# EAGLE design Mixer-Analog-OPA1644-Rev-D (EAGLE 8.5.0)
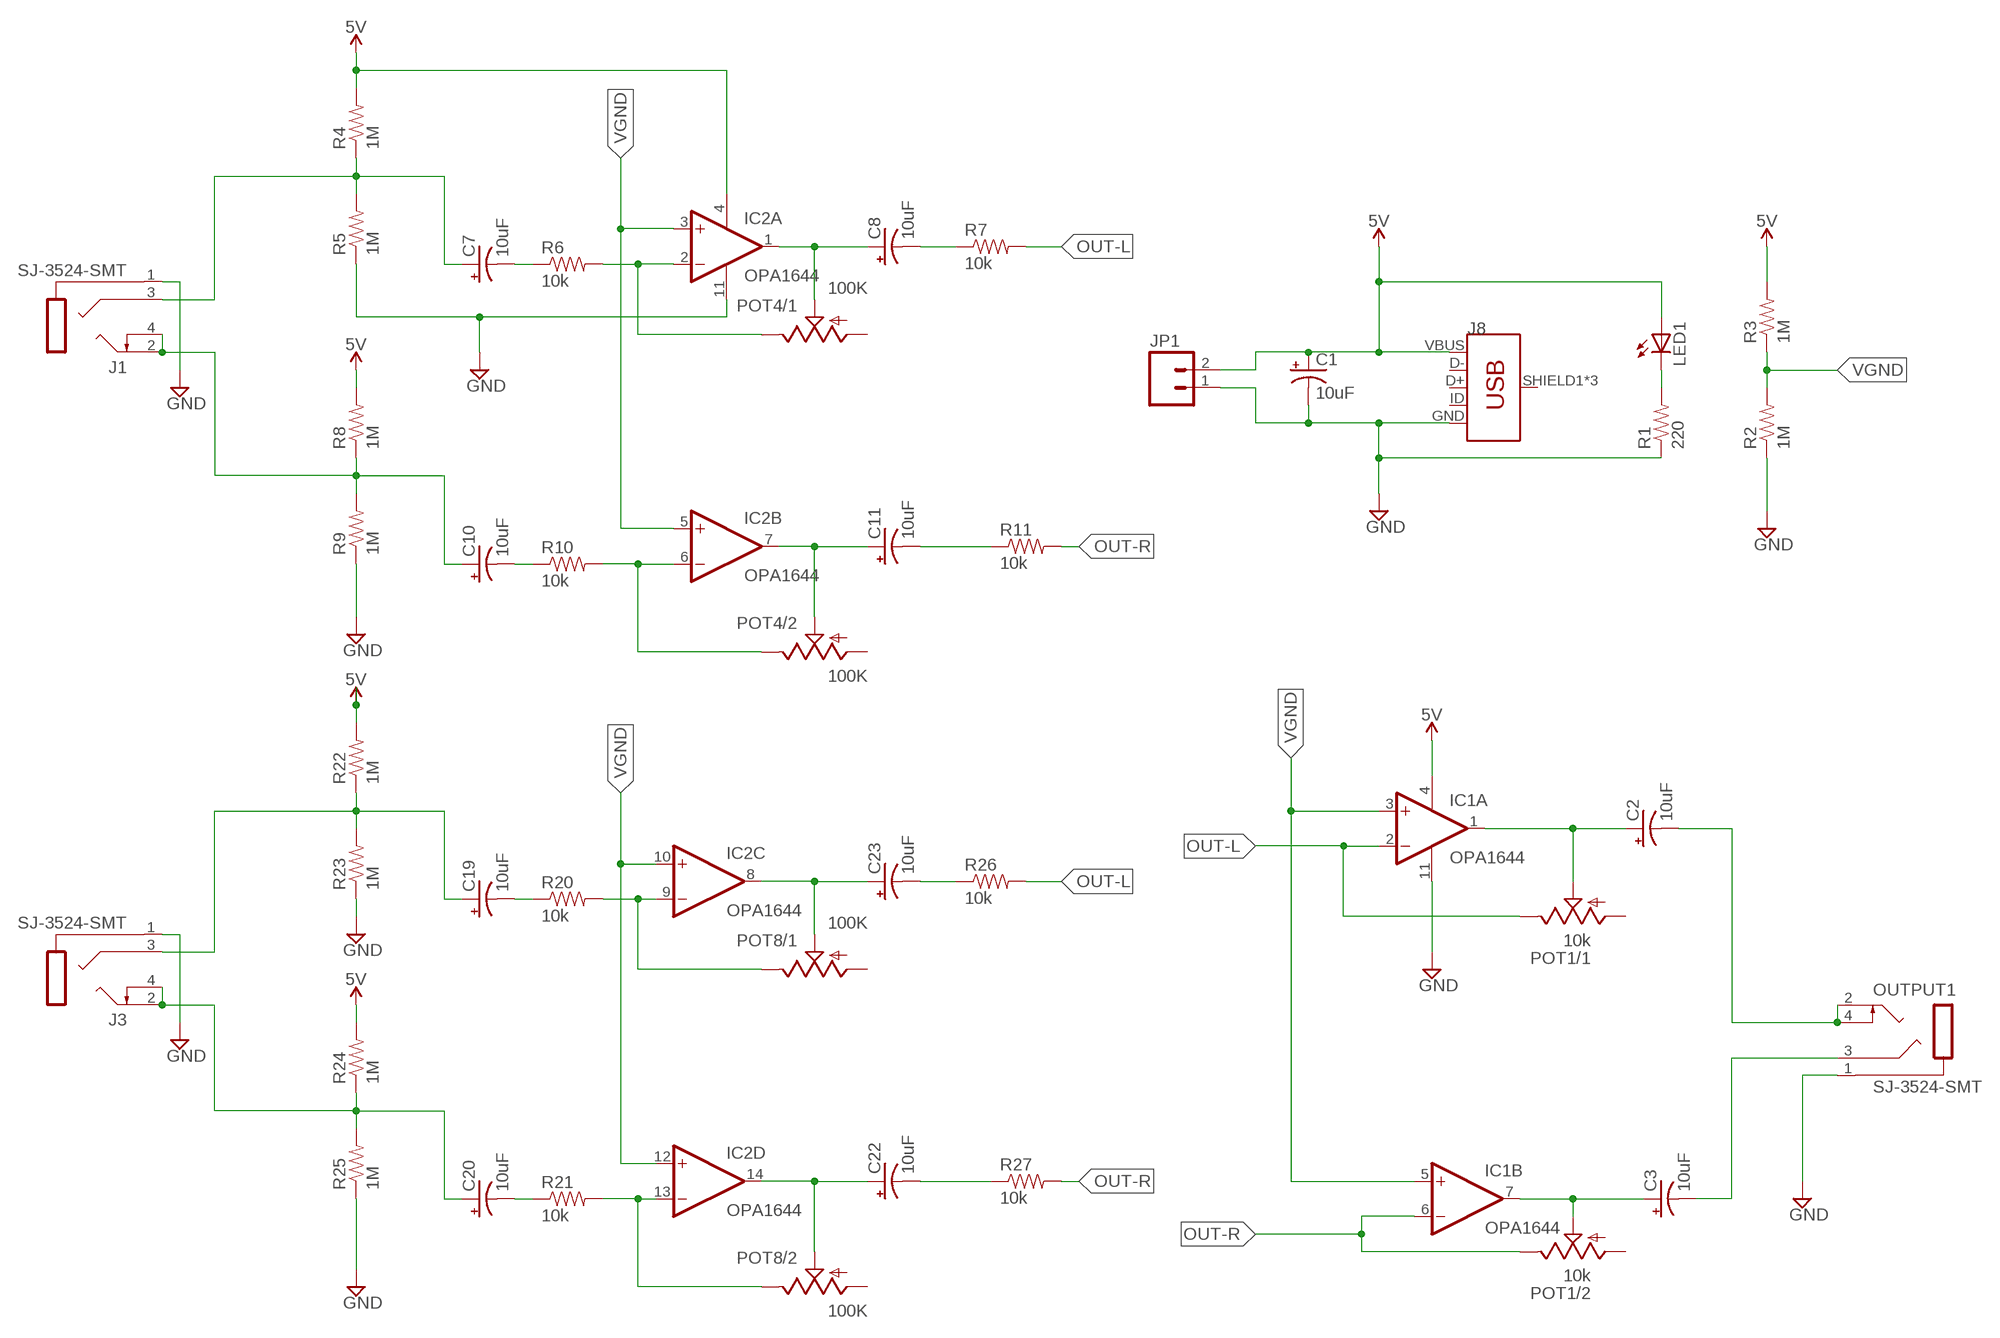
[diagram p0: schematic, sheet 1]

## Parts
C1  10uF  CAP_POL1206-KIT  [EIA3216-KIT]
C2  10uF  CAP_POL1206-KIT  [EIA3216-KIT]
C3  10uF  CAP_POL1206-KIT  [EIA3216-KIT]
C7  10uF  CAP_POL1206-KIT  [EIA3216-KIT]
C8  10uF  CAP_POL1206-KIT  [EIA3216-KIT]
C10  10uF  CAP_POL1206-KIT  [EIA3216-KIT]
C11  10uF  CAP_POL1206-KIT  [EIA3216-KIT]
C19  10uF  CAP_POL1206-KIT  [EIA3216-KIT]
C20  10uF  CAP_POL1206-KIT  [EIA3216-KIT]
C22  10uF  CAP_POL1206-KIT  [EIA3216-KIT]
C23  10uF  CAP_POL1206-KIT  [EIA3216-KIT]
IC1  OPA1644  [TSSOP14]
IC2  OPA1644  [TSSOP14]
J1  SJ-3524-SMT  [SJ-3524-SMT]
J3  SJ-3524-SMT  [SJ-3524-SMT]
J8  USB_MICRO-B_FEMALE-SMT  [USB-B-MICRO-SMD]
JP1  M02LOCK  [1X02_LOCK]
LED1  LED3MM  [LED3MM]
OUTPUT1  SJ-3524-SMT  [SJ-3524-SMT]
POT1  10k  POT-DUAL-PTV112-4420  [PTV112]
POT4  100K  POT-DUAL-PTV112-4420  [PTV112]
POT8  100K  POT-DUAL-PTV112-4420  [PTV112]
R1  220  RESISTOR0603-RES  [0603-RES]
R2  1M  RESISTOR0603-RES  [0603-RES]
R3  1M  RESISTOR0603-RES  [0603-RES]
R4  1M  RESISTOR0603-RES  [0603-RES]
R5  1M  RESISTOR0603-RES  [0603-RES]
R6  10k  RESISTOR0603-RES  [0603-RES]
R7  10k  RESISTOR0603-RES  [0603-RES]
R8  1M  RESISTOR0603-RES  [0603-RES]
R9  1M  RESISTOR0603-RES  [0603-RES]
R10  10k  RESISTOR0603-RES  [0603-RES]
R11  10k  RESISTOR0603-RES  [0603-RES]
R20  10k  RESISTOR0603-RES  [0603-RES]
R21  10k  RESISTOR0603-RES  [0603-RES]
R22  1M  RESISTOR0603-RES  [0603-RES]
R23  1M  RESISTOR0603-RES  [0603-RES]
R24  1M  RESISTOR0603-RES  [0603-RES]
R25  1M  RESISTOR0603-RES  [0603-RES]
R26  10k  RESISTOR0603-RES  [0603-RES]
R27  10k  RESISTOR0603-RES  [0603-RES]

## Nets
5V: C1.A(+) IC1.4(P:V+) IC2.4(P:V+) J8.VBUS JP1.2 LED1.A R3.2 R4.2 R8.2 R24.2
DLE: C8.A(+) IC2.1(A:OUT) POT4.1.2(/1:S)
DLE2: C23.A(+) IC2.8(C:OUT) POT8.1.2(/1:S)
GND: C1.C(-) IC1.11(P:V-) IC2.11(P:V-) J1.1(S) J3.1(S) J8.GND JP1.1 OUTPUT1.1(S) R1.1 R2.1 R5.1 R9.1 R23.1 R25.1
N$1: IC2.6(B:-IN) POT4.2.3(/2:E) R10.2
N$2: C8.C(-) R7.1
N$3: C10.A(+) J1.2(T) J1.4(TS) R8.1 R9.2
N$4: IC2.2(A:-IN) POT4.1.3(/1:E) R6.2
N$6: C11.C(-) R11.1
N$7: C2.A(+) IC1.1(A:OUT) POT1.1.2(/1:S)
N$8: C7.C(-) R6.1
N$10: C7.A(+) J1.3(R) R4.1 R5.2
N$14: C10.C(-) R10.1
N$15: LED1.K(C) R1.2
N$17: C3.A(+) IC1.7(B:OUT) POT1.2.2(/2:S)
N$24: C11.A(+) IC2.7(B:OUT) POT4.2.2(/2:S)
N$34: C22.A(+) IC2.14(D:OUT) POT8.2.2(/2:S)
N$35: IC2.13(D:-IN) POT8.2.3(/2:E) R21.2
N$39: C20.A(+) J3.2(T) J3.4(TS) R24.1 R25.2
N$40: C19.A(+) J3.3(R) R22.1 R23.2
N$42: C19.C(-) R20.1
N$43: IC2.9(C:-IN) POT8.1.3(/1:E) R20.2
N$45: C20.C(-) R21.1
N$46: C23.C(-) R26.1
N$47: C22.C(-) R27.1
N$48: R22.2 ; supply symbol labelled 5V
N$61: C2.C(-) OUTPUT1.2(T) OUTPUT1.4(TS)
N$62: C3.C(-) OUTPUT1.3(R)
OUT-L: IC1.2(A:-IN) POT1.1.3(/1:E) R7.2 R26.2
OUT-R: IC1.6(B:-IN) POT1.2.3(/2:E) R11.2 R27.2
VGND: IC1.3(A:+IN) IC1.5(B:+IN) IC2.3(A:+IN) IC2.5(B:+IN) IC2.10(C:+IN) IC2.12(D:+IN) R2.2 R3.1
Unconnected: IC1.8(C:OUT) IC1.9(C:-IN) IC1.10(C:+IN) IC1.12(D:+IN) IC1.13(D:-IN) IC1.14(D:OUT) J8.D+ J8.D- J8.ID J8.SHIELD1(SHIELD) J8.SHIELD2(SHIELD) J8.SHIELD3(SHIELD) POT1.1.1(/1:A) POT1.2.1(/2:A) POT4.1.1(/1:A) POT4.2.1(/2:A) POT8.1.1(/1:A) POT8.2.1(/2:A)

## Library data of the parts
C1-C3 = SparkFun-Passives:CAP_POL: Capacitor Polarized These are standard SMD and PTH capacitors. Normally 10uF, 47uF, and 100uF in electrolytic and tantalum varieties. Always verify the external diameter of the through hole cap, it varies with capacity, voltage, and manufacturer. The EIA devices should be standard.
C7 C8 C10 C11 C19 C20 C22 C23 = SparkFun-Passives:CAP_POL: Capacitor Polarized These are standard SMD and PTH capacitors. Normally 10uF, 47uF, and 100uF in electrolytic and tantalum varieties. Always verify the external diameter of the through hole cap, it varies with capacity, voltage, and manufacturer. The EIA devices should be standard.; SPICEPREFIX: C
IC1 = CMU-ArtFab:OPA1644: OPA164x SoundPlus™ High-Performance, JFET-Input Audio Operational Amplifiers Source: http://www.ti.com/lit/ds/symlink/opa1642.pdf
IC2 = CMU-ArtFab:OPA1644: OPA164x SoundPlus™ High-Performance, JFET-Input Audio Operational Amplifiers Source: http://www.ti.com/lit/ds/symlink/opa1642.pdf; SPICEPREFIX: B
J1 J3 = con-cuistack:SJ-3524: 3.5 Stereo audio jack (SMT); SPICEPREFIX: E
J8 = SparkFun-Connectors:USB_MICRO-B: USB Type Micro-B Connector Male/female and PTH/SMT variants SparkFun Products: SparkFun microB USB Breakout <https://www.sparkfun.com/products/12035> SparkFun USB microB Plug Breakout <https://www.sparkfun.com/products/10031> SparkFun ESP8266 Thing <https://www.sparkfun.com/products/13231>; PROD_ID: CONN-11752
JP1 = CMU-ArtFab:M02: Header 2 Standard 2-pin 0.1" header. Use with straight break away headers (SKU : PRT-00116), right angle break away headers (PRT-00553), swiss pins (PRT-00743), machine pins (PRT-00117), and female headers (PRT-00115). Molex polarized connector foot print use with SKU : PRT-08233 with associated crimp pins and housings.
LED1 = led:LED: LED OSRAM: - CHIPLED LG R971, LG N971, LY N971, LG Q971, LY Q971, LO R971, LY R971 LH N974, LH R974 LS Q976, LO Q976, LY Q976 LO Q996 - Hyper CHIPLED LW Q18S LB Q993, LB Q99A, LB R99A - SideLED LS A670, LO A670, LY A670, LG A670, LP A670 LB A673, LV A673, LT A673, LW A673 LH A674 LY A675 LS A676, LA A676, LO A676, LY A676, LW A676 LS A679, LY A679, LG A679 - Hyper Micro SIDELED® LS Y876, LA Y876, LO Y876, LY Y876 LT Y87S - SmartLED LW L88C, LW L88S LB L89C, LB L89S, LG L890 LS L89K, LO L89K, LY L89K LS L896, LA L896, LO L896, LY L896 - TOPLED LS T670, LO T670, LY T670, LG T670, LP T670 LSG T670, LSP T670, LSY T670, LOP T670, LYG T670 LG T671, LOG T671, LSG T671 LB T673, LV T673, LT T673, LW T673 LH T674 LS T676, LA T676, LO T676, LY T676, LB T676, LH T676, LSB T676, LW T676 LB T67C, LV T67C, LT T67C, LS T67K, LO T67K, LY T67K, LW E67C LS E67B, LA E67B, LO E67B, LY E67B, LB E67C, LV E67C, LT E67C LW T67C LS T679, LY T679, LG T679 LS T770, LO T770, LY T770, LG T770, LP T770 LB T773, LV T773, LT T773, LW T773 LH T774 LS E675, LA E675, LY E675, LS T675 LS T776, LA T776, LO T776, LY T776, LB T776 LHGB T686 LT T68C, LB T68C - Hyper Mini TOPLED® LB M676 - Mini TOPLED Santana® LG M470 LS M47K, LO M47K, LY M47K Source: http://www.osram.convergy.de LUXEON: - LUMILED® LXK2-PW12-R00, LXK2-PW12-S00, LXK2-PW14-U00, LXK2-PW14-V00 LXK2-PM12-R00, LXK2-PM12-S00, LXK2-PM14-U00 LXK2-PE12-Q00, LXK2-PE12-R00, LXK2-PE12-S00, LXK2-PE14-T00, LXK2-PE14-U00 LXK2-PB12-K00, LXK2-PB12-L00, LXK2-PB12-M00, LXK2-PB14-N00, LXK2-PB14-P00, LXK2-PB14-Q00 LXK2-PR12-L00, LXK2-PR12-M00, LXK2-PR14-Q00, LXK2-PR14-R00 LXK2-PD12-Q00, LXK2-PD12-R00, LXK2-PD12-S00 LXK2-PH12-R00, LXK2-PH12-S00 LXK2-PL12-P00, LXK2-PL12-Q00, LXK2-PL12-R00 Source: www.luxeon.com KINGBRIGHT: KA-3528ASYC Source: www.kingbright.com
OUTPUT1 = con-cuistack:SJ-3524: 3.5 Stereo audio jack (SMT)
POT1 = CMU-ArtFab:POT-DUAL-PTV112: Bourns 11mm dual potentiometer; AVAILABILITY: Unavailable; DESCRIPTION: Alt# Tce-10111410; MF: STMicroelectronics; MP: PTV112; PACKAGE: None; PRICE: None
POT4 POT8 = CMU-ArtFab:POT-DUAL-PTV112: Bourns 11mm dual potentiometer; AVAILABILITY: Unavailable; DESCRIPTION: Alt# Tce-10111410; MF: STMicroelectronics; MP: PTV112; PACKAGE: None; PRICE: None; SPICEPREFIX: J
R1-R3 = SparkFun-Passives:RESISTOR: Resistor Basic schematic elements and footprints for 0603, 1206, and PTH resistors.
R4-R11 R20-R27 = SparkFun-Passives:RESISTOR: Resistor Basic schematic elements and footprints for 0603, 1206, and PTH resistors.; SPICEPREFIX: R

## Board
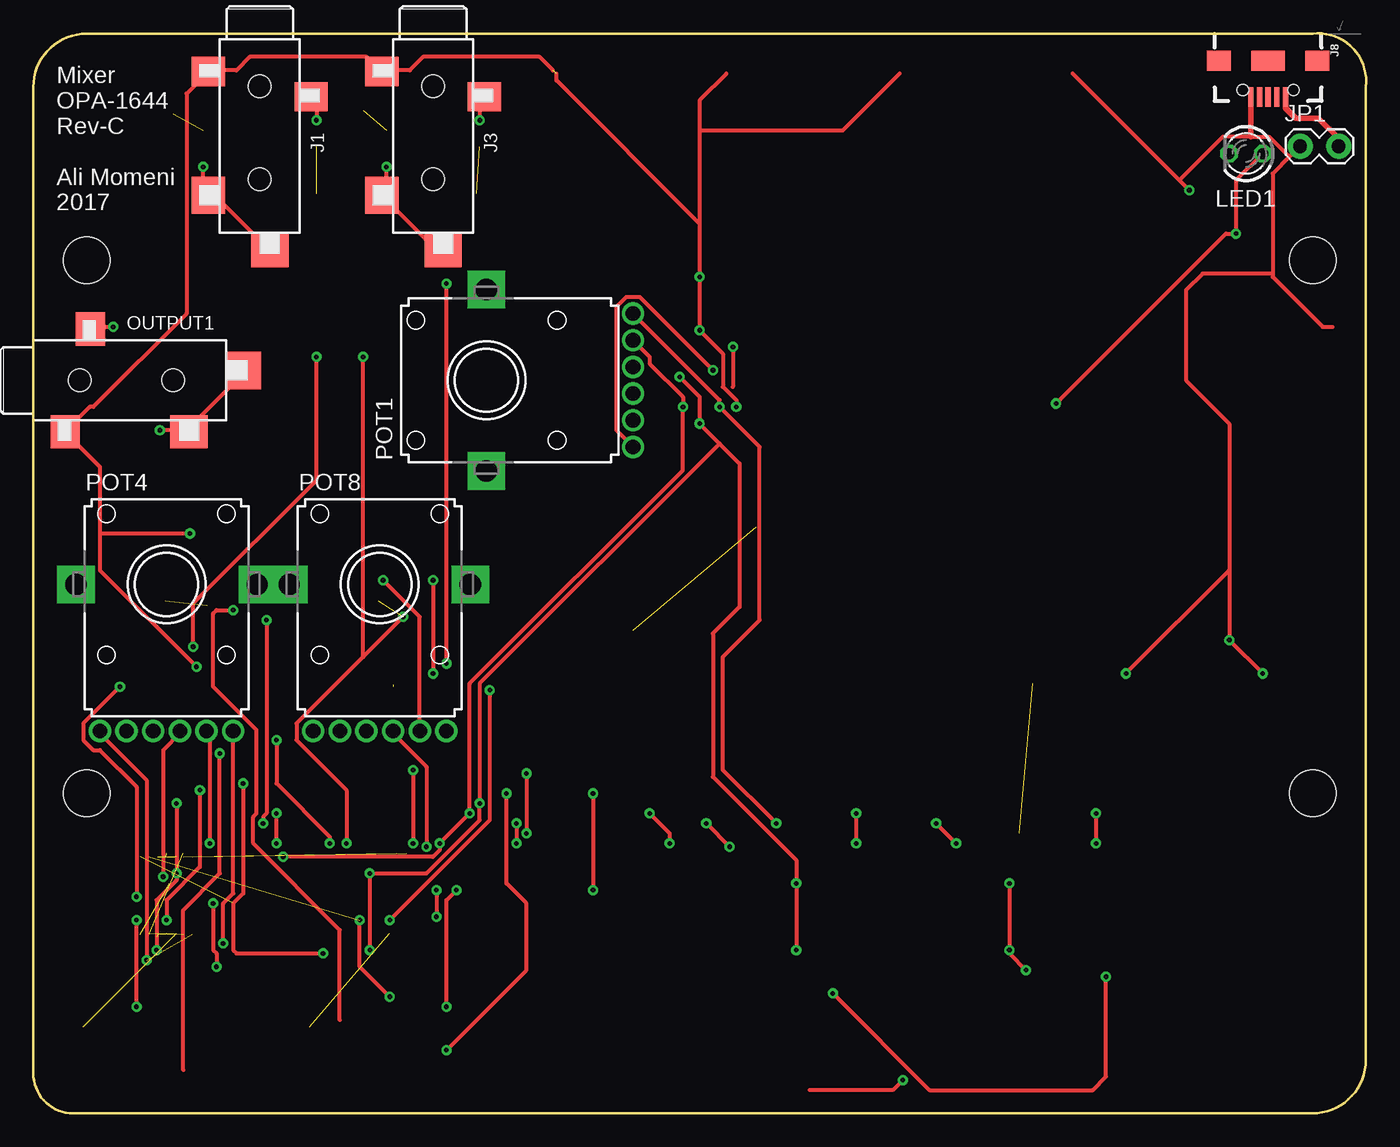
[diagram p1: board, top side]
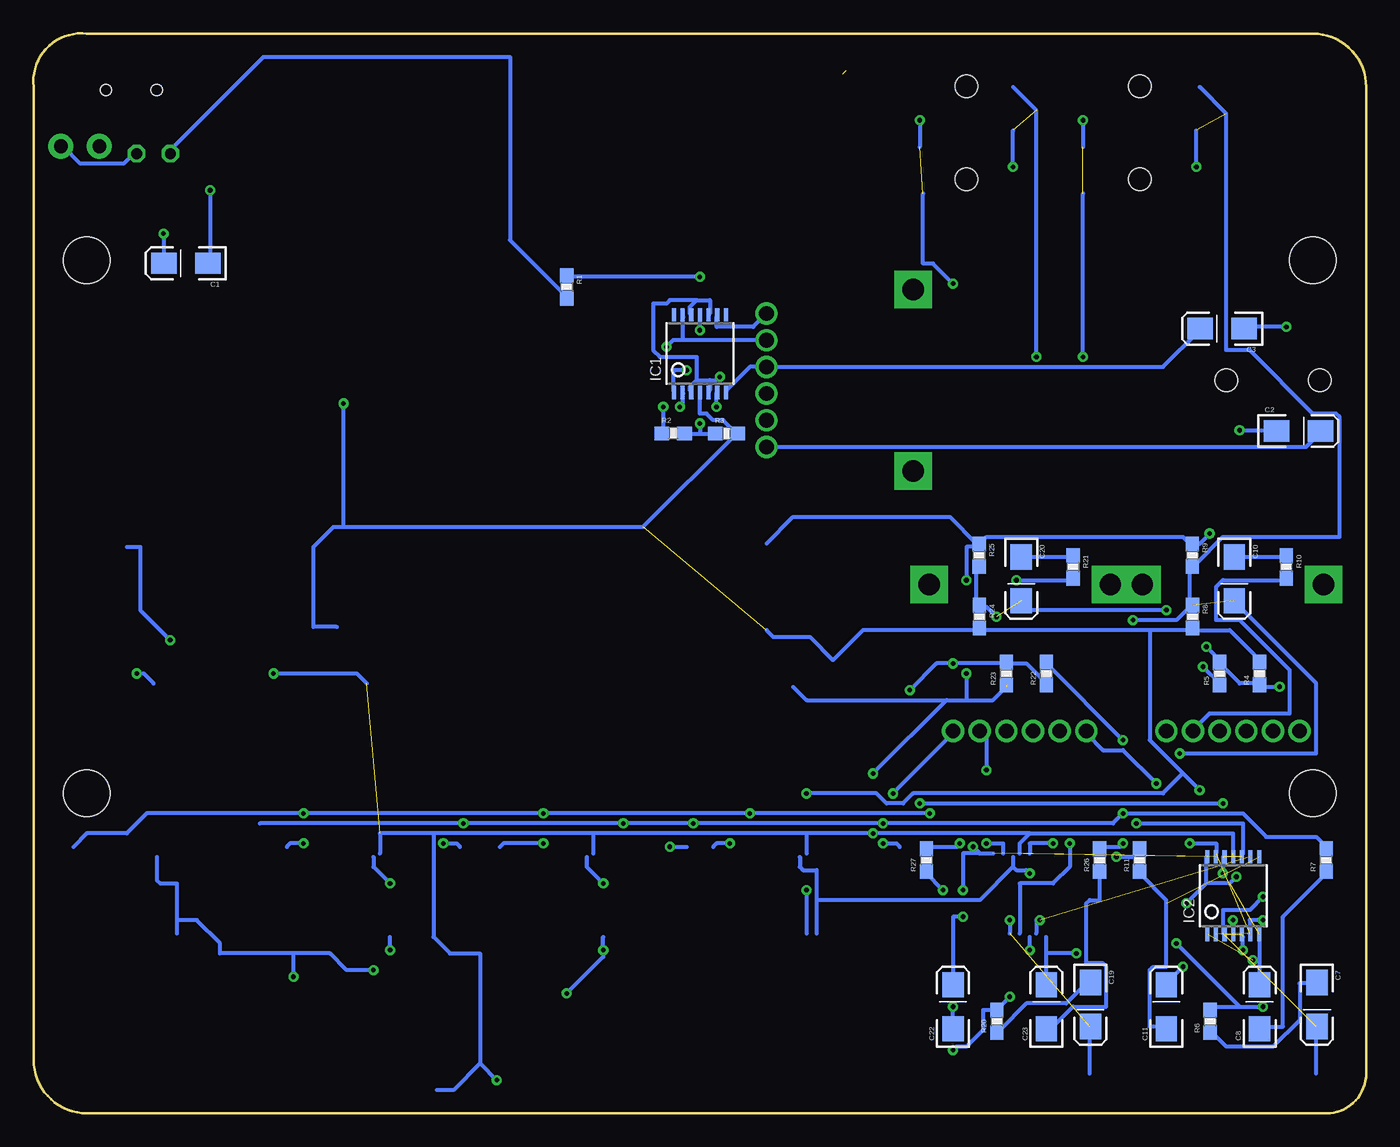
[diagram p2: board, bottom side, seen from below]

Size 100.02 x 81.02 mm. Coordinates in mm from the lower left corner, seen from the top.
Outline: 0,3 arc90 3,0 96,0 arc90 100,4 100,77 arc103 96,81 4,81 arc90 0,77 0,3
Copper layers (1*16): Top 0.035mm / dielectric 1.5mm / Bottom 0.035mm
Design rules "default *": minimum track width 12mil, minimum drill 0.35mm, track to track 8mil, track to pad 8mil, pad to pad 8mil, via to via 8mil, smd to smd 8mil, copper to edge 40mil, drill to drill 6mil, minimum pad ring 10mil, minimum via ring 8mil, stop-mask expansion 4mil, vias tented up to drill 0mil, thermal gap 10mil
Holes 3.5 mm at 96,64 4,64 96,24 4,24

### Footprints (pad centres in the part's own frame; a part is rotated, then mirrored left to right if it is on the bottom)
EIA3216-KIT = smd 1.9 x 1.6: A 1.65,0; C -1.65,0
TSSOP14 = smd 0.305 x 0.991: 1 -1.95,-2.918; 2 -1.3,-2.918; 3 -0.65,-2.918; 4 0,-2.918; 5 0.65,-2.918; 6 1.3,-2.918; 7 1.95,-2.918; 8 1.95,2.918; 9 1.3,2.918; 10 0.65,2.918; 11 0,2.918; 12 -0.65,2.918; 13 -1.3,2.918; 14 -1.95,2.918
SJ-3524-SMT = smd 2.5 x 2.2: 1 3.85,-4.6; 3 -3.85,-2.7 | smd 2.5 x 2.8: 2 3.85,4.7 | smd 2.8 x 2.5: 4 -0.75,8.85 | hole 1.7: 0,-3.5; 0,3.5
USB-B-MICRO-SMD = smd 1.45 x 0.4: D+ 2.725,0; D- 2.725,0.65; GND 2.725,-1.3; ID 2.725,-0.65; VBUS 2.725,1.3 | smd 1.5 x 1.8: SHIELD1 0,3.685; SHIELD2 0,-3.685 | smd 1.5 x 2.5: SHIELD3 0,0 | hole 0.85: 2.2,1.9; 2.2,-1.9
1X02_LOCK = drill 1.016 pad 1.88: 1 -0.178,0; 2 2.718,0
LED3MM = drill 0.813 octagon: A -1.27,0; K 1.27,0
PTV112 = drill 1.1 pad 1.676: 1.1 -3,-11; 1.2 -5,-11; 1.3 5,-11; 2.1 -1,-11; 2.2 1,-11; 2.3 3,-11 | drill 1.6 pad 2.8 square: M1 -6.8,0; M2 6.8,0
0603-RES = smd 1.1 x 1: 1 -0.85,0; 2 0.85,0

### Placement (x,y rotation side)
C1  88.57,63.77 180 bottom
C2  5.08,51.19 0 bottom
C3  10.81,58.87 180 bottom
C7  3.69,8.16 270 bottom
C8  8,8 90 bottom
C10  9.89,40.1 270 bottom
C11  15,8 90 bottom
C19  20.69,8.16 270 bottom
C20  25.89,40.1 270 bottom
C22  31,8 90 bottom
C23  24,8 90 bottom
IC1  50,57 0 bottom
IC2  9.98,16.34 0 bottom
J1  17,73.57 180 top
J3  30,73.57 180 top
J8  92.66,78.96 270 top
JP1  95.24,72.55 0 top
LED1  91,72 180 top
OUTPUT1  6.99,54.99 270 top
POT1  34,55 90 top
POT4  10,39.68 0 top
POT8  26,39.68 0 top
R1  60,62 270 bottom
R2  52,51.01 0 bottom
R3  48,51 0 bottom
R4  8,33 90 bottom
R5  11,32.99 90 bottom
R6  11.71,6.91 90 bottom
R7  3,19 90 bottom
R8  13.03,37.27 270 bottom
R9  13.05,41.87 270 bottom
R10  6,41 270 bottom
R11  17,19 90 bottom
R20  27.71,6.91 90 bottom
R21  22,41 270 bottom
R22  24,33 90 bottom
R23  27,32.99 90 bottom
R24  29.03,37.27 270 bottom
R25  29.05,41.87 270 bottom
R26  20,19 90 bottom
R27  33,19 90 bottom

### Tracks (layer width: path | path; a pad name or v marks a point on that pad's centre or on a via)
5V  (via drill 0.35)  (2 unrouted)
  Top 0.305: v10,14.5 10,16 12.5,18.5 v12.5,24.25 | v42,24 v42,16.75 | LED1.A 92.25,72 90.25,70 v90.25,66 89.5,66 v76.75,53.25
  Top 0.406: J8.VBUS 93.96,75.43 94.74,74.65 96.44,74.65 97.96,73.13 JP1.2
  Bottom 0.305: 45,36.25 44.5,35.75 41.75,35.75 40,34 37.75,36.25 29.25,36.25 R24.2 29,36.25 16.25,36.25 | v10,14.5 10,13.5 | 13.75,25.5 16.25,28 16.25,36.25 | 13.75,25.5 v12.5,24.25 | 16.25,36.25 13.25,36.25 R8.2 13,36.25 10.25,36.25 8,34 R4.2 | v42,16.75 42,13.5 | v42,24 36.75,24 36,23.25 34.75,23.25 34,24 15.25,24 13.75,25.5 | v90.25,66 90.25,64 C1.A | JP1.2 97.75,72.5 96.5,71.25 93.25,71.25 92.5,72 LED1.A | IC1.4 50,52.5 49.5,52.5 49,52 48.25,52 47.25,51 | 47.25,51 54.25,44 76.75,44 | 76.75,44 77.5,44 79,42.5 79,36.5 77.25,36.5 | 47.25,51 R3.2 | 76.75,44 v76.75,53.25
DLE  (via drill 0.35)  (1 unrouted)
  Top 0.305: v8.5,11.5 8.5,25 5,28.5 POT4.1.2
  Bottom 0.305: C8.A 8,11.5 | 8,11.5 8,13.25 | v8.5,11.5 8,11.5
DLE2  (via drill 0.35)  (1 unrouted)
  Top 0.305: v21.75,12 15.25,12 15,12.25 15,15.75 15.75,16.5 v15.75,24.75
  Bottom 0.305: C23.A 24,12 | 24,12 24,13.25 | v21.75,12 24,12 | v15.75,24.75 18.25,27.25 19.75,27.25 21,28.5 POT8.1.2
GND  (via drill 0.35)  (4 unrouted)
  Top 0.305: 58.25,1.75 64.5,1.75 v65.25,2.5 | v12.25,33.5 5,40.75 5,43.5 | 5,43.5 5,48.5 2.5,51 OUTPUT1.1 4.25,53 4.5,53 11.5,60 11.5,76.5 13,78 J1.1 13.25,78.25 15.25,78.25 16.25,79.25 25,79.25 26,78.25 J3.1 26.25,78.25 28.25,78.25 29.25,79.25 38,79.25 39,78.25 | v30,40 v30,33 | v11.75,43.5 5,43.5 | 50,73.75 50,76 52,78 | 50,73.75 50,66.75 | 50,66.75 v50,62.75 v50,58.75 51.75,57 51.75,54.5 52.75,53.5 v52.75,53 | 39.25,78 39.25,77.5 50,66.75 | 65,78 60.75,73.75 50,73.75 | 78,78 86,70 | 86,70 v86.75,69.25 | v92.25,33 v89.75,35.5 89.75,40.75 | 97.5,59 96.75,59 93,62.75 93,63 | 93,63 93,70.5 94.25,71.75 | 94.25,71.75 95,72.5 JP1.1 | 89.75,40.75 89.75,51.75 86.5,55 86.5,61.75 87.75,63 93,63 | 89.75,40.75 v82,33 | 86,70 89.25,73.25 91.36,73.25 92.75,73.25 94.25,71.75 | v37,25.5 v37,21
  Top 0.406: J8.GND 91.36,73.25
  Bottom 0.305: 10,19.5 10,21 25.25,21 | 25.25,21 26,20.25 26,19.5 | 42,21 42,19.5 | 25.25,21 v37,21 42,21 | 58,21 58,19.5 | 42,21 58,21 | 74,19.5 74,21 70,21 | 58,21 70,21 | 69.75,1.75 68.5,1.75 66.5,3.75 | 66.5,3.75 66.5,12 68.75,12 70,13.25 70,21 | 66.5,3.75 v65.25,2.5 | v12.25,33.5 11,32.25 R5.1 | 27,32 28,31 30,31 | 31.5,31 42,31 43,32 | 31.5,31 30,31 | R25.1 29,42.75 28.5,43.25 13.75,43.25 13.25,42.75 R9.1 13,42.75 12.5,42.75 v11.75,43.5 | 45,42.75 43,44.75 31.25,44.75 29.25,42.75 R25.1 | v30,33 30,31 | v30,40 30,42.5 29.25,42.5 R25.1 | v50,58.75 IC1.11 | v52.75,53 52.75,51.25 R2.1 | v50,62.75 60,62.75 R1.1 | v86.75,69.25 86.75,64 C1.C | 91,32.25 91.75,33 v92.25,33 | v89.75,35.5 92,37.75 92,42.5 93,42.5 | 75,32.25 75.75,33 v82,33 | 31.5,31 v37,25.5
N$1  (via drill 0.35)  (1 unrouted)
  Top 0.305: v13.25,20.25 13.25,28.25 13,28.5 POT4.2.3
  Bottom 0.305: 11.25,19.5 11.25,20.25 v13.25,20.25 | R10.2 6,40 10.75,40 11.25,39.5 11.25,37 9.5,37 5.75,33.25 5.75,30 11.75,30 13,28.75 POT4.2.3
N$2
  Bottom 0.305: R7.1 3,18 6.25,14.75 6.25,6.5 8,6.5 C8.C
N$3  (via drill 0.35)  (2 unrouted)
  Top 0.305: v14,27 14,18 11.25,15.25 11.25,3.25 | v17.25,21.75 17.25,22.25 17.5,22.5 v17.5,37 | 12.75,69.75 12.75,69.25 13,69 J1.2 12.75,69.75 | 12.75,69.75 v12.75,71 | 12.75,69.75 17.75,64.75 J1.4
  Bottom 0.305: v14,27 3.75,27 3.75,32.25 9.75,38.25 C10.A | 9.25,19.5 9.25,21.75 v17.25,21.75 | v17.5,37 14.25,37 13.25,38 R8.1 13.25,38.25 13.25,41 R9.2 13,41.25 12.75,41.25 10.75,43.25 2,43.25 2,52.25 2.25,52.5 4,52.5 8.75,57.25 10.5,57.25 10.5,75 12.5,77 | v12.75,71 12.75,73.75
N$4  (via drill 0.35)  (1 unrouted)
  Top 0.305: v7.75,8 v7.75,14.5 | POT4.1.3 15,16.5 14.25,15.75 v14.25,12.75
  Bottom 0.305: 8.75,13.5 8.75,14.5 v7.75,14.5 | 9.5,8 11.5,8 R6.2 | 9.5,8 v7.75,8 | 9.5,8 v14.25,12.75
N$6
  Bottom 0.305: R11.1 17,18 15,16 15,11 16,11 16.25,10.75 16.25,6.5 15,6.5 C11.C
N$7  (via drill 0.35)
  Top 0.305: v51,55.75 45.5,61.25 44.5,61.25 43.75,60.5 43.75,51.25 POT1.1.2
  Bottom 0.305: v51,55.75 52,55.75 52,54.25 IC1.1 | POT1.1.2 4.5,50 3.5,51 C2.A
N$8
  Bottom 0.305: R6.1 11.5,6 10.5,5 7,5 5,7 5,9.75 3.75,9.75 C7.C
N$10  (via drill 0.35)  (2 unrouted)
  Top 0.305: v21.25,74.5 21.25,76 21,76.25 J1.3 | v7.75,16.25 7.75,24.5 5,27.25 4.5,27.25 3.75,28 3.75,29.25 v6.5,32 | v21.25,56.75 21.25,47.5 12,38.25 v12,35
  Bottom 0.305: v21.25,74.5 21.25,72.5 | 10.75,13.5 10.75,15.25 8.75,15.25 v7.75,16.25 | v6.5,32 8,32 R4.1 8,32.25 9.5,32.25 11,33.75 R5.2 11,34 v12,35 | v21.25,56.75 21.25,69 | 3.75,3 3.75,6.5 C7.A
N$14
  Bottom 0.305: C10.C 6,41.75 R10.1
N$15
  Bottom 0.305: R1.2 60,61.25 64.25,65.5 64.25,79.25 82.75,79.25 89.5,72.5 89.5,72 LED1.K
N$17
  Bottom 0.305: IC1.7 48,54.25 46.25,56 POT1.2.2 15.25,56 12.5,58.75 C3.A
N$24  (via drill 0.35)  (1 unrouted)
  Top 0.305: v9.75,17.75 9.75,27.25 11,28.5 POT4.2.2 | v13.75,11 13.75,12 13.5,12.25 v13.5,15.75
  Bottom 0.305: 12,17.25 12,19.25 | 12,17.25 10.25,17.25 v9.75,17.75 | v13.75,11 15,9.75 C11.A | 12,17.25 v13.5,15.75
N$34  (via drill 0.35)  (1 unrouted)
  Top 0.305: v29.5,20 29.5,26 27,28.5 POT8.2.2 | v30.25,16.75 v30.25,14.75
  Bottom 0.305: 29,19.5 28,19.5 | v29.5,20 29,19.5 | C22.A 31,14.75 v30.25,14.75 | v30.25,16.75 30.25,19.5 29,19.5
N$35  (via drill 0.35)  (1 unrouted)
  Top 0.305: v28.5,25.75 v28.5,20.25 | v26.25,40 29,37.25 POT8.2.3
  Bottom 0.305: 27.25,19.5 27.25,20.25 v28.5,20.25 | v28.5,25.75 28.5,28.5 29,28.5 POT8.2.3 | v26.25,40 22,40 R21.2
N$39  (via drill 0.35)  (2 unrouted)
  Top 0.305: v23.5,20.25 23.5,24.25 19.75,28 19.75,29.25 24.75,34.25 | v27.75,37.25 24.75,34.25 | 24.75,34.25 v24.75,56.75 | v15,37.75 13.75,37.75 13.5,37.5 13.5,32 16.75,28.75 16.75,22.5 16.5,22.25 16.5,20.25 23,13.75 23,7 | v26.5,71 26.5,69.25 26.25,69 J3.2 26.25,68.75 30.25,64.75 30.75,64.75 J3.4
  Bottom 0.305: 25.25,19.5 25.25,20.25 v23.5,20.25 | v27.75,37.25 28.5,38 29,38 R24.1 29.25,38.25 29.25,41 R25.2 | 26.5,77 24.75,75.25 v24.75,56.75 | v15,37.75 25.25,37.75 25.75,38.25 C20.A | v26.5,71 26.5,73.75
N$40  (via drill 0.35)  (2 unrouted)
  Top 0.305: v33.5,74.5 33.5,76 33.75,76.25 J3.3 | v26.75,14.5 34.25,22 v34.25,31.75 | v31,33.75 v31,62.25
  Bottom 0.305: v33.5,74.5 33.5,72.5 | v26.75,14.5 26.75,13.5 | v34.25,31.75 32.25,33.75 v31,33.75 27,33.75 | 27,33.75 25.5,33.75 24,32.25 R22.1 | 27,33.75 R23.2 | 33.25,69 33.25,63.75 32.5,63.75 v31,62.25 | 20.75,3 20.75,6.5 C19.A
N$42
  Bottom 0.305: R20.1 27.5,6.25 25.5,8.25 22.5,8.25 21,9.75 20.75,9.75 C19.C
N$43  (via drill 0.35)  (1 unrouted)
  Top 0.305: v24.5,14.5 24.5,11 v26.75,8.75 | v35.5,24 35.5,17.25 37,15.75 37,10.75 v31,4.75
  Bottom 0.305: 24.75,13.5 24.75,14.5 v24.5,14.5 | v26.75,8.75 27.5,8 R20.2 27.75,7.75 28.75,7.75 28.75,6.25 30,5 30.75,5 v31,4.75 | v35.5,24 31,28.5 POT8.1.3
N$45
  Bottom 0.305: C20.C 22,41.75 R21.1
N$46
  Bottom 0.305: R26.1 20,16 20.75,16 21,15.75 21,11.25 19.75,11.25 19.5,11 19.5,8 22,8 23.5,6.5 24,6.5 C23.C
N$47  (via drill 0.35)
  Top 0.305: v31.75,16.75 31,16 v31,8
  Bottom 0.305: v31.75,16.75 33,18 R27.1 | C22.C v31,8
N$48  (via drill 0.35)
  Top 0.305: v22.25,20.25 22.25,20.75 18.25,24.75 v18.25,28
  Bottom 0.305: 26,13.5 26,17.25 23.5,17.25 22.25,18.5 v22.25,20.25 | v18.25,28 24,33.75 R22.2
N$61  (via drill 0.35)
  Top 0.305: 11.5,51.25 v9.5,51.25 | 11.5,51.25 15.75,55.5 OUTPUT1.4 | 11.5,51.25 OUTPUT1.2
  Bottom 0.305: v9.5,51.25 6.75,51.25 C2.C
N$62  (via drill 0.35)
  Top 0.305: v6,59 4.5,59 OUTPUT1.3
  Bottom 0.305: v6,59 9,59 C3.C
OUT-L  (via drill 0.35)
  Top 0.305: POT1.1.3 51.5,53.5 v51.5,53 54.5,50 54.5,37 51.75,34.25 51.75,25.75 v55.75,21.75 | v18.25,20.25 v18.25,22.5 | v36.25,21.75 v36.25,20.25 | v50.5,21.75 v52.25,20 | v67.75,21.75 v69.25,20.25
  Bottom 0.305: 48.75,59.75 48.75,59 46,59 POT1.1.3 | v51.5,53 51.25,53 51.25,54 IC1.2 | v18.25,20.25 18.5,20 20,20 R26.2 | R7.2 3,20 3.75,20.75 7.5,20.75 9.25,22.5 v18.25,22.5 19,21.75 v36.25,21.75 v50.5,21.75 v55.75,21.75 v67.75,21.75 83,21.75 | 35,20 35.25,20.25 v36.25,20.25 | v52.25,20 51,20 | 68,20 68.25,20.25 v69.25,20.25
OUT-R  (via drill 0.35)
  Top 0.305: POT1.2.3 46.25,56.75 46.25,56.25 48.75,53.75 v48.75,53 48.75,48.25 32.75,32.25 v32.75,22.5 v30.5,20.25 30.5,19.75 30,19.25 v18.75,19.25 | v52.5,57.5 52.5,54.5 | v47.75,20.25 47.75,21 v46.25,22.5 | v61.75,22.5 v61.75,20.25 | v79.75,22.5 v79.75,20.25
  Bottom 0.305: v48.75,53 48.75,54 IC1.6 | 51.25,58 51.25,59.75 | POT1.2.3 51.25,58 | v52.5,57.5 52,58 51.25,58 | v18.75,19.25 17.5,19.25 17,19.75 R11.2 | v30.5,20.25 30.75,20 33,20 R27.2 | 49,20 48.75,20.25 v47.75,20.25 | v32.75,22.5 v46.25,22.5 v61.75,22.5 v79.75,22.5 91.5,22.5 93,21 96,21 97,20 | 65,20 64.75,20.25 v61.75,20.25 | 81,20 80.75,20.25 v79.75,20.25
VGND  (via drill 0.35)  (4 unrouted)
  Top 0.305: v9.25,12.25 9.25,16 10.75,17.5 v10.75,18 v10.75,23.25 | v25.25,12.25 v25.25,18 29.5,18 33.5,22 v33.5,23.25 33.5,32.25 51.5,50.25 | v73.25,17.25 v73.25,12.25 73.25,12 v74.5,10.75 | v57.25,12.25 v57.25,17.25 57.25,19 51,25.25 51,36 53,38 53,48.75 51.5,50.25 | v48.5,55.25 50,53.75 v50,51.75 51.5,50.25 | v80.5,10.25 80.5,2.75 79.5,1.75 67.25,1.75 v60,9
  Bottom 0.305: v9.25,12.25 9.25,13.25 | 10.75,19.25 v10.75,18 | 41.25,16 41.25,18.25 42.25,18.25 42.5,18.5 42.5,19.25 | 41.25,16 41.25,13.5 | v25.25,12.25 25.25,13.25 | v25.25,18 25.5,18.25 26.25,18.25 26.5,18.5 | 26.5,19.25 26.5,18.5 | 41.25,16 29,16 26.5,18.5 | v33.5,23.25 v10.75,23.25 | 89.25,14.5 89.25,17.25 90.5,17.25 90.75,17.5 90.75,19.25 | 89.25,14.5 89.25,13.5 | v73.25,12.25 73.25,13.25 | v73.25,17.25 74.5,18.5 74.5,19.25 | 89.25,14.5 87.75,14.5 86,12.75 86,12 80.5,12 | 80.5,12 77.75,12 76.5,10.75 v74.5,10.75 | 57.25,13.25 v57.25,12.25 57.25,11.75 v60,9 | v57.25,17.25 58.5,18.5 58.5,19.25 | 50,51 51,51 R2.2 | 50,51 R3.1 | 49.25,55 49.25,54.25 IC1.5 | 50.25,55 49.25,55 | 50.25,55 50.75,54.5 50.75,54.25 IC1.3 | 49.25,60 49.25,61 50.25,61 | 50.25,61 50.75,60.5 50.75,60 | 50.25,55 50.25,56.75 53,56.75 53.5,57.25 53.5,60.75 52.5,60.75 52.25,61 50.25,61 | v50,51.75 50,51 | v48.5,55.25 48.75,55 49.25,55 | v80.5,10.25 80.5,12

### Text on the board
tNames: Mixer / OPA-1644 / Rev-C / / Ali Momeni / 2017